# EasyEDA Pro project ProPrj_GSPro Keyboard_2026-01-17.epro, schematic DaughterBoard
Board Name: Keyboard; Create Date: 2026-01-06; Page Name: KEYBOARD; Project Name: GSPro Keyboard; Schematic Name: Daughter; Update Date: 2026-01-06; Company: EasyEDA.com; Page Size: A4; Version: V1.0
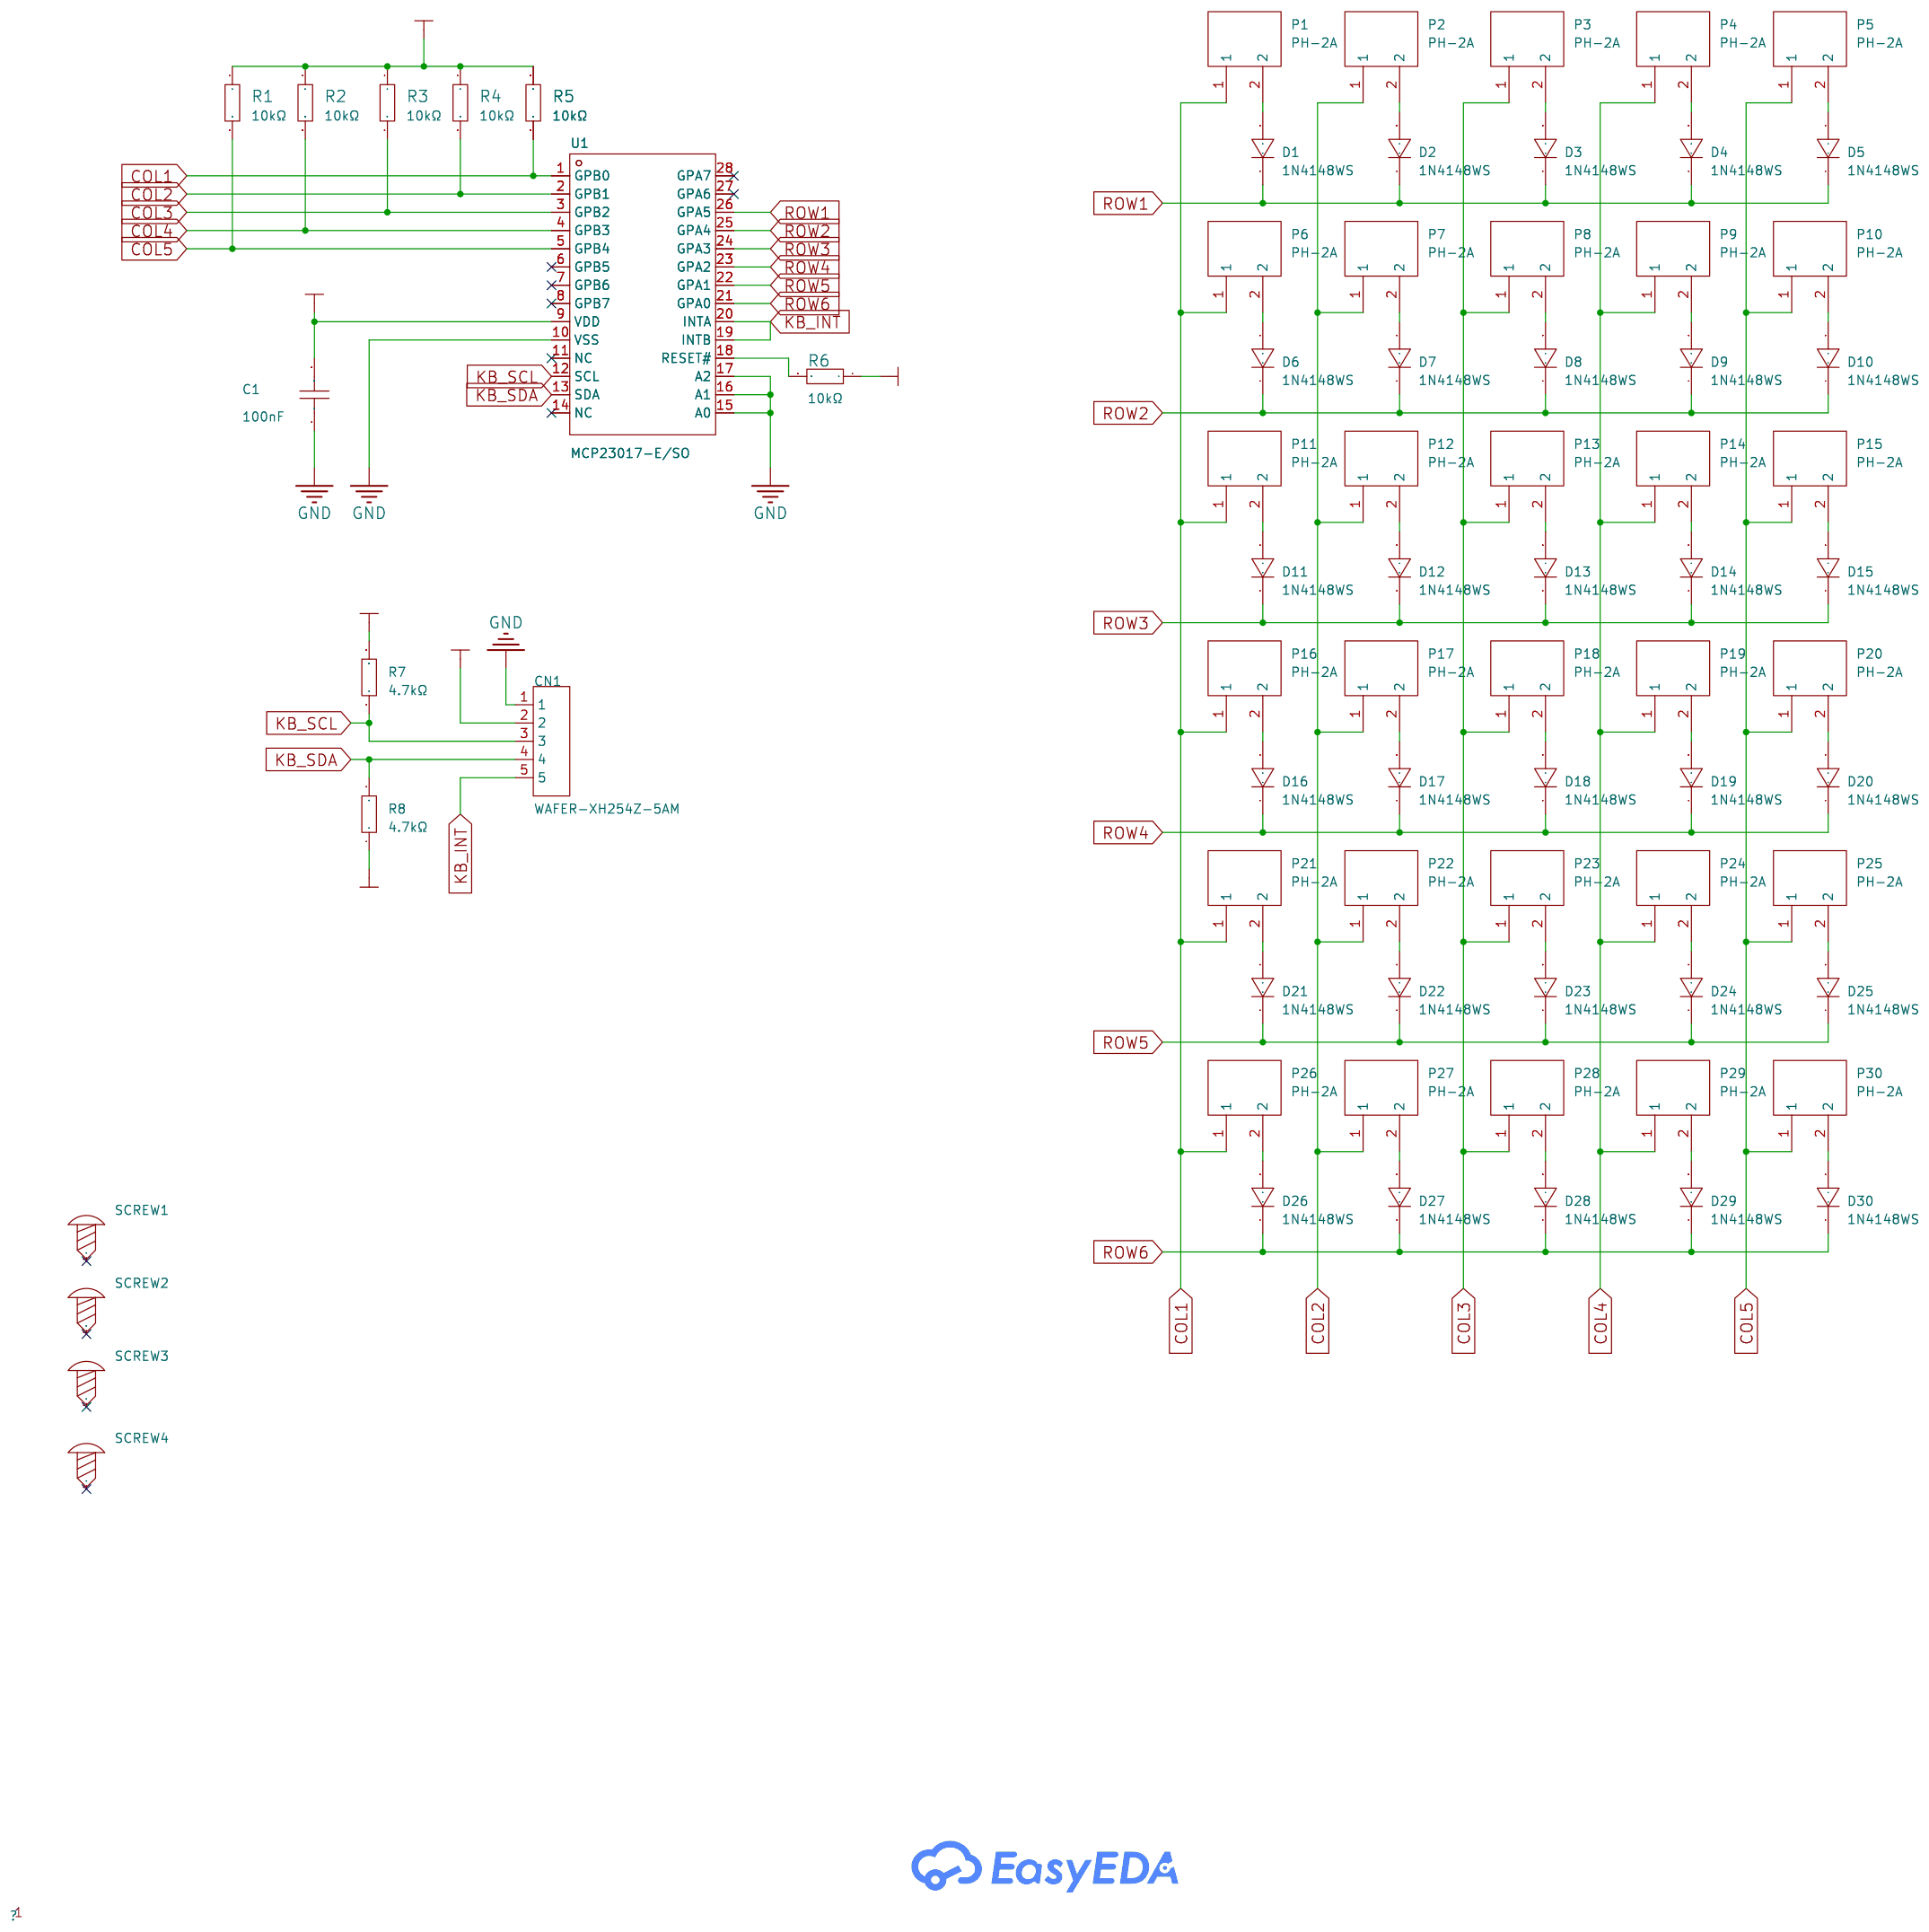
[diagram p2: schematic sheet]

## Parts
C1  100nF  [C0603]
CN1  WAFER-XH254Z-5AM  [CONN-TH_5P-P2.50_WAFER-XH254Z-5A]
D1  1N4148WS  [SOD-323_L1.8-W1.3-LS2.5-RD]
D2  1N4148WS  [SOD-323_L1.8-W1.3-LS2.5-RD]
D3  1N4148WS  [SOD-323_L1.8-W1.3-LS2.5-RD]
D4  1N4148WS  [SOD-323_L1.8-W1.3-LS2.5-RD]
D5  1N4148WS  [SOD-323_L1.8-W1.3-LS2.5-RD]
D6  1N4148WS  [SOD-323_L1.8-W1.3-LS2.5-RD]
D7  1N4148WS  [SOD-323_L1.8-W1.3-LS2.5-RD]
D8  1N4148WS  [SOD-323_L1.8-W1.3-LS2.5-RD]
D9  1N4148WS  [SOD-323_L1.8-W1.3-LS2.5-RD]
D10  1N4148WS  [SOD-323_L1.8-W1.3-LS2.5-RD]
D11  1N4148WS  [SOD-323_L1.8-W1.3-LS2.5-RD]
D12  1N4148WS  [SOD-323_L1.8-W1.3-LS2.5-RD]
D13  1N4148WS  [SOD-323_L1.8-W1.3-LS2.5-RD]
D14  1N4148WS  [SOD-323_L1.8-W1.3-LS2.5-RD]
D15  1N4148WS  [SOD-323_L1.8-W1.3-LS2.5-RD]
D16  1N4148WS  [SOD-323_L1.8-W1.3-LS2.5-RD]
D17  1N4148WS  [SOD-323_L1.8-W1.3-LS2.5-RD]
D18  1N4148WS  [SOD-323_L1.8-W1.3-LS2.5-RD]
D19  1N4148WS  [SOD-323_L1.8-W1.3-LS2.5-RD]
D20  1N4148WS  [SOD-323_L1.8-W1.3-LS2.5-RD]
D21  1N4148WS  [SOD-323_L1.8-W1.3-LS2.5-RD]
D22  1N4148WS  [SOD-323_L1.8-W1.3-LS2.5-RD]
D23  1N4148WS  [SOD-323_L1.8-W1.3-LS2.5-RD]
D24  1N4148WS  [SOD-323_L1.8-W1.3-LS2.5-RD]
D25  1N4148WS  [SOD-323_L1.8-W1.3-LS2.5-RD]
D26  1N4148WS  [SOD-323_L1.8-W1.3-LS2.5-RD]
D27  1N4148WS  [SOD-323_L1.8-W1.3-LS2.5-RD]
D28  1N4148WS  [SOD-323_L1.8-W1.3-LS2.5-RD]
D29  1N4148WS  [SOD-323_L1.8-W1.3-LS2.5-RD]
D30  1N4148WS  [SOD-323_L1.8-W1.3-LS2.5-RD]
P1  PH-2A  [CONN-TH_2P-P2.00_PH-2A_C2319]
P2  PH-2A  [CONN-TH_2P-P2.00_PH-2A_C2319]
P3  PH-2A  [CONN-TH_2P-P2.00_PH-2A_C2319]
P4  PH-2A  [CONN-TH_2P-P2.00_PH-2A_C2319]
P5  PH-2A  [CONN-TH_2P-P2.00_PH-2A_C2319]
P6  PH-2A  [CONN-TH_2P-P2.00_PH-2A_C2319]
P7  PH-2A  [CONN-TH_2P-P2.00_PH-2A_C2319]
P8  PH-2A  [CONN-TH_2P-P2.00_PH-2A_C2319]
P9  PH-2A  [CONN-TH_2P-P2.00_PH-2A_C2319]
P10  PH-2A  [CONN-TH_2P-P2.00_PH-2A_C2319]
P11  PH-2A  [CONN-TH_2P-P2.00_PH-2A_C2319]
P12  PH-2A  [CONN-TH_2P-P2.00_PH-2A_C2319]
P13  PH-2A  [CONN-TH_2P-P2.00_PH-2A_C2319]
P14  PH-2A  [CONN-TH_2P-P2.00_PH-2A_C2319]
P15  PH-2A  [CONN-TH_2P-P2.00_PH-2A_C2319]
P16  PH-2A  [CONN-TH_2P-P2.00_PH-2A_C2319]
P17  PH-2A  [CONN-TH_2P-P2.00_PH-2A_C2319]
P18  PH-2A  [CONN-TH_2P-P2.00_PH-2A_C2319]
P19  PH-2A  [CONN-TH_2P-P2.00_PH-2A_C2319]
P20  PH-2A  [CONN-TH_2P-P2.00_PH-2A_C2319]
P21  PH-2A  [CONN-TH_2P-P2.00_PH-2A_C2319]
P22  PH-2A  [CONN-TH_2P-P2.00_PH-2A_C2319]
P23  PH-2A  [CONN-TH_2P-P2.00_PH-2A_C2319]
P24  PH-2A  [CONN-TH_2P-P2.00_PH-2A_C2319]
P25  PH-2A  [CONN-TH_2P-P2.00_PH-2A_C2319]
P26  PH-2A  [CONN-TH_2P-P2.00_PH-2A_C2319]
P27  PH-2A  [CONN-TH_2P-P2.00_PH-2A_C2319]
P28  PH-2A  [CONN-TH_2P-P2.00_PH-2A_C2319]
P29  PH-2A  [CONN-TH_2P-P2.00_PH-2A_C2319]
P30  PH-2A  [CONN-TH_2P-P2.00_PH-2A_C2319]
R1  10kΩ  [R0603]
R2  10kΩ  [R0603]
R3  10kΩ  [R0603]
R4  10kΩ  [R0603]
R5  10kΩ  [R0603]
R6  10kΩ  [R0603]
R7  4.7kΩ  [R0603]
R8  4.7kΩ  [R0603]
SCREW1  -  [Screw-Hole-M3]
SCREW2  -  [Screw-Hole-M3]
SCREW3  -  [Screw-Hole-M3]
SCREW4  -  [Screw-Hole-M3]
U1  MCP23017-E/SO  [SOIC-28_L18.0-W7.5-P1.27-LS10.3-BL]

## Library data of the parts
C1 = CC0603KRX7R9BB104: Capacitance:100nF Tolerance:±10% Tolerance:±10% Voltage Rating:50V Temperature Coefficient:X7R; LCSC Part Name: 100nF ±10% 50V; Supplier Part: C14663; Manufacturer: YAGEO(国巨); Supplier Footprint: 0603; JLCPCB Part Class: Basic Part; Datasheet: https://item.szlcsc.com/datasheet/CC0603KRX7R9BB104/15331.html; Supplier: LCSC; Tolerance: ±10%; Voltage Rating: 50V; Temperature Coefficient: X7R
CN1 = WAFER-XH254Z-5AM: Pins Structure:1x5P Pitch:2.54mm Mounting Type:Through Hole Reference Series:XH Number of Pins:5P Number of Rows:1 Number of PINs Per Row:5 Current Rating:3A Contact Material:Brass Operating Temperature:-25℃~+85℃ Operating Temperature:-25℃~+85℃ Voltage Ra; LCSC Part Name: 1x5P 间距:2.54mm 直插 系列:XH; Supplier Part: C22751825; Manufacturer: HANBO(汉博); Supplier Footprint: 插件,P=2.54mm; JLCPCB Part Class: Extended Part; Datasheet: https://item.szlcsc.com/datasheet/WAFER-XH254Z-5AM/24478760.html; Supplier: LCSC; Pins Structure: 1x5P; Pitch: 2.54mm; Mounting Type: Through Hole; Reference Series: XH; Number of Pins: 5P; Number of Rows: 1; Number of PINs Per Row: 5; Current Rating: 3A; Contact Material: Brass; Operating Temperature: -25℃~+85℃; Voltage Rating: 250V; Plastic Material: PA66; Flame Retardant Rating: UL94V-0
D1-D30 = 1N4148WS_C2128: Diode Configuration:Independent Voltage - Forward(Vf@If):1.25V@150mA Voltage - DC Reverse(Vr):100V Current - Rectified:150mA Pd - Power Dissipation:200mW Reverse Leakage Current (Ir):1uA@75V Reverse Recovery Time (trr):4ns Operating Junction Temperature R; LCSC Part Name: 丝印T4 1N4148WS; Supplier Part: C2128; Manufacturer: CJ(江苏长电/长晶); Supplier Footprint: SOD-323; JLCPCB Part Class: Basic Part; Datasheet: https://item.szlcsc.com/datasheet/1N4148WS/2485.html; Supplier: LCSC; Diode Configuration: Independent; Voltage - Forward(Vf@If): 1.25V@150mA; Voltage - DC Reverse(Vr): 100V; Current - Rectified: 150mA; Pd - Power Dissipation: 200mW; Reverse Leakage Current (Ir): 1uA@75V; Reverse Recovery Time (trr): 4ns; Non-Repetitive Peak Forward Surge Current: 2A
P1-P30 = PH-2A_C2319: Pins Structure:1x2P Pitch:2mm Mounting Type:Through Hole Reference Series:PH Number of Pins:2P Number of Rows:1 Number of PINs Per Row:2 Row Spacing:- Current Rating:2A Contact Material:Brass Contact Plating:Tin Operating Temperature:-25℃~+85℃ Operating T; LCSC Part Name: 1x2P 间距:2mm 直插 系列:PH; Supplier Part: C2319; Manufacturer: BOOMELE(博穆精密); Supplier Footprint: 插件,P=2mm; JLCPCB Part Class: Extended Part; Datasheet: https://item.szlcsc.com/datasheet/PH-2A/2693.html; Supplier: LCSC; Pins Structure: 1x2P; Pitch: 2mm; Mounting Type: Through Hole; Reference Series: PH; Number of Pins: 2P; Number of Rows: 1; Number of PINs Per Row: 2; Current Rating: 2A; Contact Material: Brass; Contact Plating: Tin; Operating Temperature: -25℃~+85℃; Voltage Rating: 100V; Plastic Material: PA66; Color: Transparent; Z-Height of the Board: 6.05mm; Y-Width of Bottom Edge on Board: 4.7mm
R1-R6 = 0603WAF1002T5E: Type:Thick Film Resistor Resistance:10kΩ Tolerance:±1% Tolerance:±1% Power(Watts):100mW Voltage-Supply(Max):75V Temperature Coefficient:±100ppm/℃ Temperature Coefficient:±100ppm/℃ Operating Temperature:-55℃~+155℃ Operating Temperature:-55℃~+155℃; LCSC Part Name: 厚膜电阻 10kΩ ±1% 100mW; Supplier Part: C25804; Manufacturer: UNI-ROYAL(厚声); Supplier Footprint: 0603; JLCPCB Part Class: Basic Part; Datasheet: https://item.szlcsc.com/datasheet/0603WAF1002T5E/26547.html; Supplier: LCSC; Type: Thick Film Resistor; Tolerance: ±1%; Power(Watts): 100mW; Voltage-Supply(Max): 75V; Temperature Coefficient: ±100ppm/℃; Operating Temperature: -55℃~+155℃
R7 R8 = 0603WAF4701T5E: Type:Thick Film Resistor Resistance:4.7kΩ Tolerance:±1% Tolerance:±1% Power(Watts):100mW Voltage-Supply(Max):75V Temperature Coefficient:±100ppm/℃ Temperature Coefficient:±100ppm/℃ Operating Temperature:-55℃~+155℃ Operating Temperature:-55℃~+155℃; LCSC Part Name: 4.7kΩ ±1% 100mW 厚膜电阻; Supplier Part: C23162; Manufacturer: UNI-ROYAL(厚声); Supplier Footprint: 0603; JLCPCB Part Class: Basic Part; Datasheet: https://item.szlcsc.com/datasheet/0603WAF4701T5E/23889.html; Supplier: LCSC; Type: Thick Film Resistor; Tolerance: ±1%; Power(Watts): 100mW; Voltage-Supply(Max): 75V; Temperature Coefficient: ±100ppm/℃; Operating Temperature: -55℃~+155℃
SCREW1-SCREW4 = Screw-Hole-M3: Supplier Footprint: 插件
U1 = MCP23017-E/SO: Interface:- Number of I/O:16 Interrupt Output:With Interrupt Output Output Type:- Voltage - Supply:1.8V~5.5V Voltage - Supply:1.8V~5.5V Current - Output Low(IOL):- Current - Output High(IOH):- Clock Frequency:1.7MHz Operating Temperature:-40℃~+85℃ Operati; LCSC Part Name: 16位I/O扩展器带串行接口; Supplier Part: C47023; Manufacturer: MICROCHIP(美国微芯); Supplier Footprint: SOIC-28-300mil; JLCPCB Part Class: Extended Part; Datasheet: https://item.szlcsc.com/datasheet/MCP23017-E%252FSO/48028.html; Supplier: LCSC; Number of I/O: 16; Interrupt Output: With Interrupt Output; Voltage - Supply: 1.8V~5.5V; Clock Frequency: 1.7MHz; Operating Temperature: -40℃~+85℃

## Nets
3V3: C1.2 CN1.2 R1.1 R2.1 R3.1 R4.1 R5.1 R6.1 R7.2 R8.1 U1.9(VDD)
GND: C1.1 CN1.1 U1.10(VSS) U1.15(A0) U1.16(A1) U1.17(A2)
COL1: P1.1 P6.1 P11.1 P16.1 P21.1 P26.1 R5.2 U1.1(GPB0)
COL2: P2.1 P7.1 P12.1 P17.1 P22.1 P27.1 R4.2 U1.2(GPB1)
COL3: P3.1 P8.1 P13.1 P18.1 P23.1 P28.1 R3.2 U1.3(GPB2)
COL4: P4.1 P9.1 P14.1 P19.1 P24.1 P29.1 R2.2 U1.4(GPB3)
COL5: P5.1 P10.1 P15.1 P20.1 P25.1 P30.1 R1.2 U1.5(GPB4)
KB_INT: CN1.5 U1.19(INTB) U1.20(INTA)
KB_SCL: CN1.3 R7.1 U1.12(SCL)
KB_SDA: CN1.4 R8.2 U1.13(SDA)
ROW1: D1.1(K) D2.1(K) D3.1(K) D4.1(K) D5.1(K) U1.26(GPA5)
ROW2: D6.1(K) D7.1(K) D8.1(K) D9.1(K) D10.1(K) U1.25(GPA4)
ROW3: D11.1(K) D12.1(K) D13.1(K) D14.1(K) D15.1(K) U1.24(GPA3)
ROW4: D16.1(K) D17.1(K) D18.1(K) D19.1(K) D20.1(K) U1.23(GPA2)
ROW5: D21.1(K) D22.1(K) D23.1(K) D24.1(K) D25.1(K) U1.22(GPA1)
ROW6: D26.1(K) D27.1(K) D28.1(K) D29.1(K) D30.1(K) U1.21(GPA0)
$1N4778: R6.2 U1.18(RESET#)
$1N5405: D1.2(A) P1.2
$1N5418: D2.2(A) P2.2
$1N5463: D3.2(A) P3.2
$1N5483: D4.2(A) P4.2
$1N5973: D6.2(A) P6.2
$1N5975: D7.2(A) P7.2
$1N5981: D8.2(A) P8.2
$1N5985: D9.2(A) P9.2
$1N6068: D5.2(A) P5.2
$1N6080: D10.2(A) P10.2
$1N6555: D11.2(A) P11.2
$1N6557: D14.2(A) P14.2
$1N6559: D12.2(A) P12.2
$1N6561: D13.2(A) P13.2
$1N6576: D15.2(A) P15.2
$1N7082: D16.2(A) P16.2
$1N7084: D19.2(A) P19.2
$1N7086: D17.2(A) P17.2
$1N7088: D18.2(A) P18.2
$1N7103: D20.2(A) P20.2
$1N7621: D21.2(A) P21.2
$1N7623: D24.2(A) P24.2
$1N7625: D22.2(A) P22.2
$1N7627: D23.2(A) P23.2
$1N7640: D25.2(A) P25.2
$1N8168: D26.2(A) P26.2
$1N8170: D29.2(A) P29.2
$1N8172: D27.2(A) P27.2
$1N8174: D28.2(A) P28.2
$1N8187: D30.2(A) P30.2

Not connected (* = marked no-connect by the designer): SCREW1 1*; SCREW2 1*; SCREW3 1*; SCREW4 1*; U1 6(GPB5)* 7(GPB6)* 8(GPB7)* 11(NC)* 14(NC)* 27(GPA6)* 28(GPA7)*
